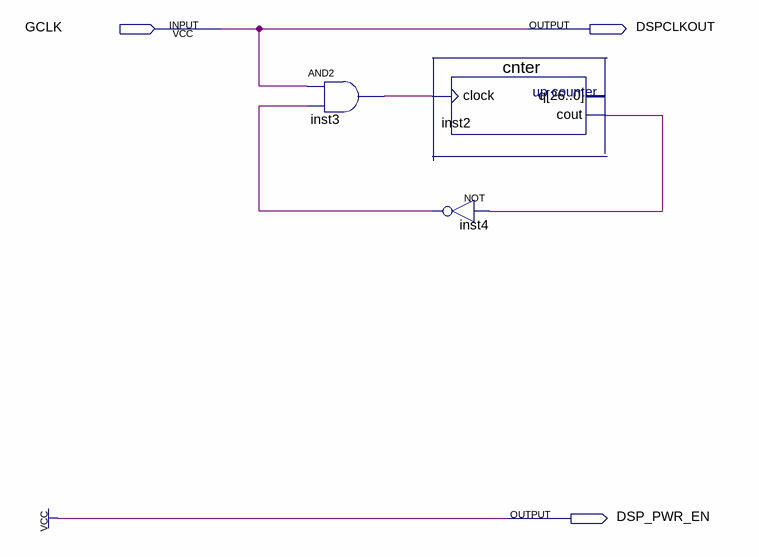
[diagram p0: schematic sheet]
// Quartus schematic basicfunctionstest.bdf as structural Verilog: 3 symbols, 3 pins
module basicfunctionstest (
  input  GCLK,
  output DSPCLKOUT,
  output DSP_PWR_EN
);

  wire inst2_cout, inst3_out, inst4_out;

  and inst3 (inst3_out, GCLK, inst4_out);
  cnter inst2 (.clock(inst3_out), .cout(inst2_cout));  // open: q
  not inst4 (inst4_out, inst2_cout);

  assign DSP_PWR_EN = 1'b1;
  assign DSPCLKOUT = GCLK;
endmodule
